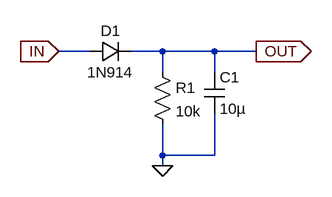
[diagram p0: schematic envelopeDetector.asc]
envelopeDetector.asc, the LTspice schematic file:
Version 4
SHEET 1 1284 680
WIRE 176 112 128 112
WIRE 288 112 240 112
WIRE 368 112 288 112
WIRE 432 112 368 112
WIRE 288 144 288 112
WIRE 368 144 368 112
WIRE 288 272 288 224
WIRE 368 272 368 208
WIRE 368 272 288 272
WIRE 288 288 288 272
FLAG 288 288 0
FLAG 128 112 IN
IOPIN 128 112 In
FLAG 432 112 OUT
IOPIN 432 112 Out
SYMBOL diode 176 128 R270
WINDOW 0 32 32 VTop 2
WINDOW 3 0 32 VBottom 2
SYMATTR InstName D1
SYMATTR Value 1N914
SYMBOL res 272 128 R0
SYMATTR InstName R1
SYMATTR Value 10k
SYMBOL cap 352 144 R0
SYMATTR InstName C1
SYMATTR Value 10µ

The netlist it stands for:
* envelopeDetector.asc
D1 IN OUT 1N914
R1 OUT 0 10k
C1 OUT 0 10µ
.model D D
.lib standard.dio
.backanno
.end